# Altium project BLDCSuperBot.PrjPcb
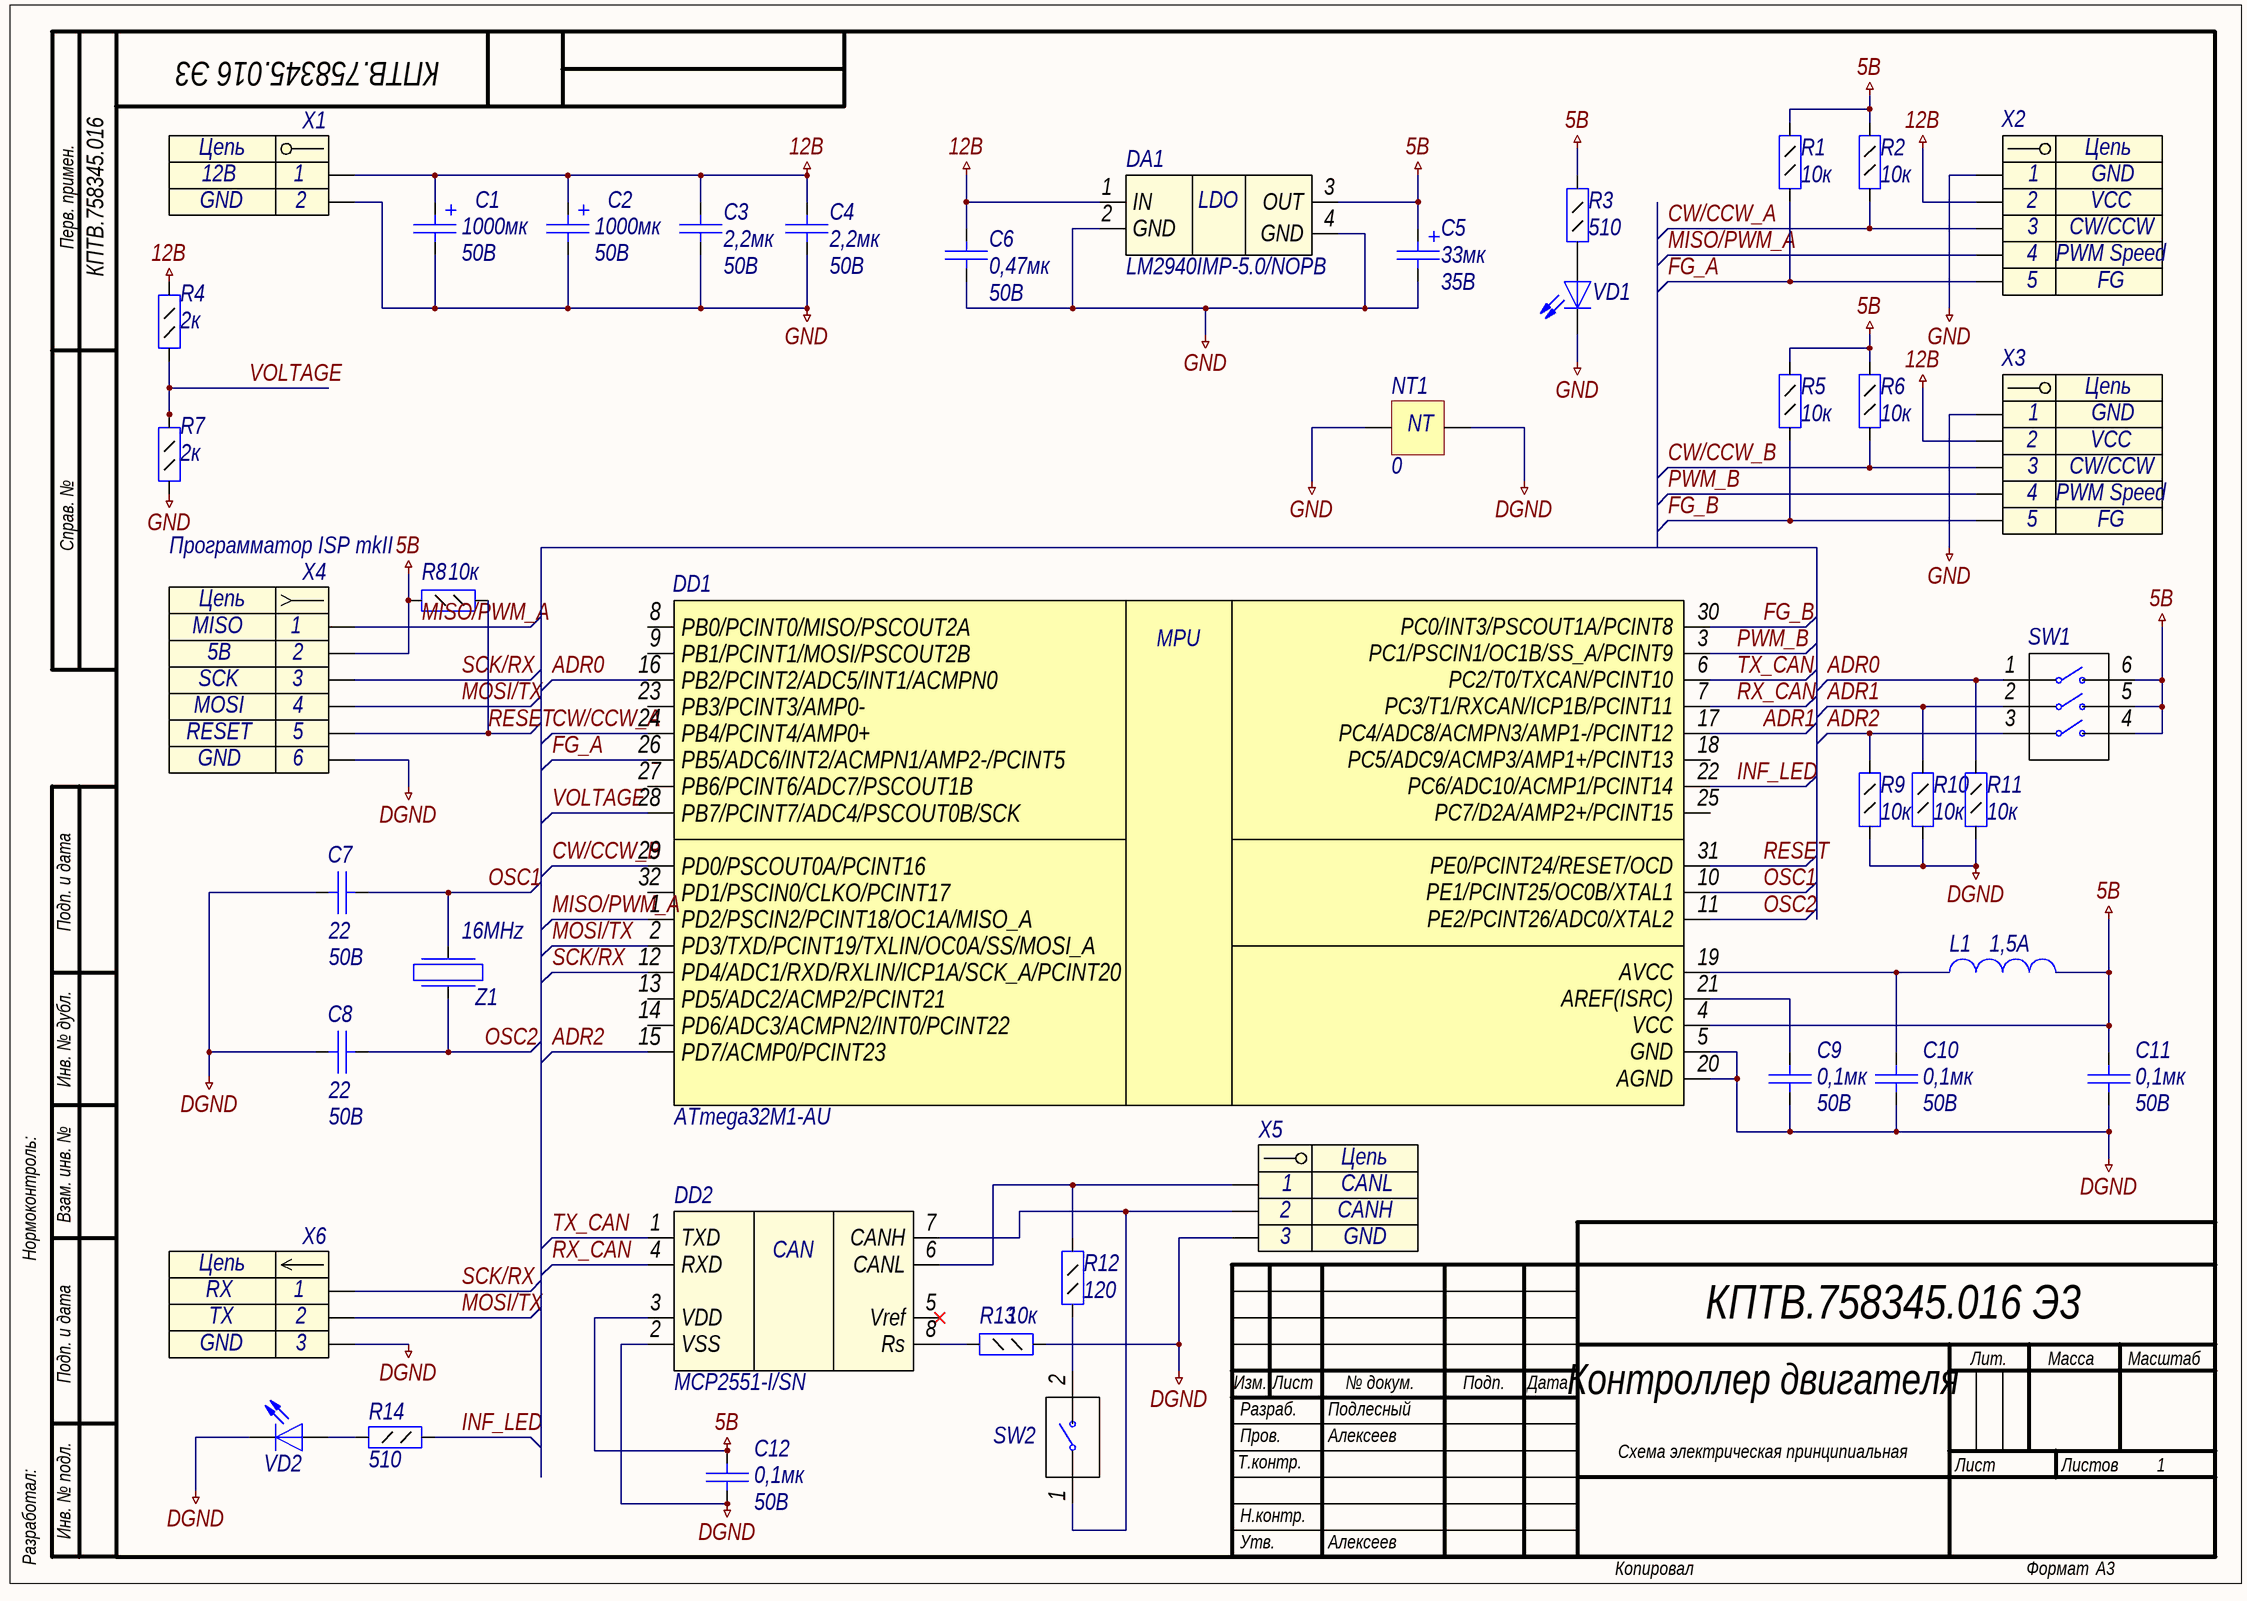
[diagram p0: BLDCSuperBot.schdoc]
1 sheet, 42 parts. Net scope: global (net labels, ports and power ports of the same name join across sheets).
Board file: BLDCSuperBot.PcbDoc

## Sheet BLDCSuperBot.schdoc: Контроллер двигателя
size 420 x 297 mm; ApprovedBy: Алексеев; CheckedBy: Алексеев; DrawnBy: Подлесный; DocumentNumber: КПТВ.758345.016 Э3; SheetTotal: 1; Title1str: (при необходимости вторая строка); DocumentType: Схема электрическая принципиальная; Format: A3; ImagePath: КПТВ.758345.016

### Parts
C1  value 1000мк  Voltage: 50В  [K50-35(13X25)_V]  (hidden comment: Capacitor_pol)
C2  value 1000мк  Voltage: 50В  [K50-35(13X25)_V]  (hidden comment: Capacitor_pol)
C3  value 2,2мк  Voltage: 50В  [C1206]  (hidden comment: Capacitor)
C4  value 2,2мк  Voltage: 50В  [C1206]  (hidden comment: Capacitor)
C5  value 33мк  Voltage: 35В  [TANTAL CASE D]  (hidden comment: Capacitor_pol)
C6  value 0,47мк  Voltage: 50B  [C0805]  (hidden comment: Capacitor)
C7  value 22  Voltage: 50В  [C0805]  (hidden comment: Capacitor)
C8  value 22  Voltage: 50В  [C0805]  (hidden comment: Capacitor)
C9  value 0,1мк  Voltage: 50В  [C0805]  (hidden comment: Capacitor)
C10  value 0,1мк  Voltage: 50В  [C0805]  (hidden comment: Capacitor)
C11  value 0,1мк  Voltage: 50В  [C0805]  (hidden comment: Capacitor)
C12  value 0,1мк  Voltage: 50В  [C0805]  (hidden comment: Capacitor)
DA1  Part Number: LM2940IMP-5.0/NOPB  [SOT-223]  (hidden comment: LM2940IMP)
DD1  ATmega32M1-AU  [TQFP-32]
DD2  MCP2551-I/SN  [SO8]
L1  Rated Current: 1,5A  [L0603]  (hidden comment: Inductor)
NT1  value 0  [Pofigistor0603]  (net tie, no BOM)
R1  value 10к  [R0805]  (hidden comment: Resistor_0,125Вт)
R2  value 10к  [R0805]  (hidden comment: Resistor_0,125Вт)
R3  value 510  [R0805]  (hidden comment: Resistor_0,125Вт)
R4  value 2к  [R0805]  (hidden comment: Resistor_0,125Вт)
R5  value 10к  [R0805]  (hidden comment: Resistor_0,125Вт)
R6  value 10к  [R0805]  (hidden comment: Resistor_0,125Вт)
R7  value 2к  [R0805]  (hidden comment: Resistor_0,125Вт)
R8  value 10к  [R0805]  (hidden comment: Resistor_0,125Вт)
R9  value 10к  [R0805]  (hidden comment: Resistor_0,125Вт)
R10  value 10к  [R0805]  (hidden comment: Resistor_0,125Вт)
R11  value 10к  [R0805]  (hidden comment: Resistor_0,125Вт)
R12  value 120  [R0805]  (hidden comment: Resistor_0,125Вт)
R13  value 10к  [R0805]  (hidden comment: Resistor_0,125Вт)
R14  value 510  [R0805]  (hidden comment: Resistor_0,125Вт)
SW1  (no value)  [DIP3]
SW2  DS1040-01  [DIP1]  (value not drawn)
VD1  LED  [L_0805]  (value not drawn)
VD2  LED  [L_0805]  (value not drawn)
X1  Header_2_trm  [TERMINAL-2WAY-5MM]  (value not drawn)
X2  Header_5_trm  [TERMINAL-5WAY-3.5MM_]  (value not drawn)
X3  Header_5_trm  [TERMINAL-5WAY-3.5MM]  (value not drawn)
X4  Программатор ISP mkII  [PLS2-6]
X5  Header_3_trm  [TERMINAL-3WAY-3.5MM]  (value not drawn)
X6  Header_3_plg  [PLS-3]  (value not drawn)
Z1  Frequence: 16MHz  [HC-49S]  (hidden comment: Crystal)

### Nets
5B: C5.1 C11.2 C12.2 DA1.3(OUT) DD1.4(VCC) DD2.3(VDD) L1.2 R1.1 R2.1 R3.2 R5.1 R6.1 R8.2 SW1.4 SW1.5 SW1.6 X4.2
12B: C1.1 C2.1 C3.2 C4.2 C6.2 DA1.1(IN) R4.2 X1.1 X2.2 X3.2
DGND: C7.2 C8.2 C9.1 C10.1 C11.1 C12.1 DD1.5(GND) DD1.20(AGND) DD2.2(VSS) NT1.2 R9.2 R10.2 R11.2 R13.1 VD2.1(K) X4.6 X5.3 X6.3
GND: C1.2 C2.2 C3.1 C4.1 C5.2 C6.1 DA1.2(GND) DA1.4(GND) NT1.1 R7.1 VD1.1(K) X1.2 X2.1 X3.1
ADR0: DD1.16(PB2/PCINT2/ADC5/INT1/ACMPN0) R11.1 SW1.1
ADR1: DD1.17(PC4/ADC8/ACMPN3/AMP1-/PCINT12) R10.1 SW1.2
ADR2: DD1.15(PD7/ACMP0/PCINT23) R9.1 SW1.3
CW/CCW_A: DD1.24(PB4/PCINT4/AMP0+) R2.2 X2.3
CW/CCW_B: DD1.29(PD0/PSCOUT0A/PCINT16) R6.2 X3.3
FG_A: DD1.26(PB5/ADC6/INT2/ACMPN1/AMP2-/PCINT5) R1.2 X2.5
FG_B: DD1.30(PC0/INT3/PSCOUT1A/PCINT8) R5.2 X3.5
INF_LED: DD1.22(PC6/ADC10/ACMP1/PCINT14) R14.1
MISO/PWM_A: DD1.1(PD2/PSCIN2/PCINT18/OC1A/MISO_A) X2.4 X4.1
MOSI/TX: DD1.2(PD3/TXD/PCINT19/TXLIN/OC0A/SS/MOSI_A) X4.4 X6.2
OSC1: C7.1 DD1.10(PE1/PCINT25/OC0B/XTAL1) Z1.2
OSC2: C8.1 DD1.11(PE2/PCINT26/ADC0/XTAL2) Z1.1
PWM_B: DD1.3(PC1/PSCIN1/OC1B/SS_A/PCINT9) X3.4
RESET: DD1.31(PE0/PCINT24/RESET/OCD) R8.1 X4.5
RX_CAN: DD1.7(PC3/T1/RXCAN/ICP1B/PCINT11) DD2.4(RXD)
SCK/RX: DD1.12(PD4/ADC1/RXD/RXLIN/ICP1A/SCK_A/PCINT20) X4.3 X6.1
TX_CAN: DD1.6(PC2/T0/TXCAN/PCINT10) DD2.1(TXD)
VOLTAGE: DD1.28(PB7/PCINT7/ADC4/PSCOUT0B/SCK) R4.1 R7.2
NetC9_2: C9.2 DD1.21(AREF(ISRC))
NetC10_2: C10.2 DD1.19(AVCC) L1.1
NetDD2_6: DD2.6(CANL) R12.2 X5.1
NetDD2_7: DD2.7(CANH) SW2.1 X5.2
NetDD2_8: DD2.8(Rs) R13.2
NetR3_1: R3.1 VD1.2(A)
NetR12_1: R12.1 SW2.2
NetR14_2: R14.2 VD2.2(A)

Not connected (* = marked no-connect by the designer): DD1 8(PB0/PCINT0/MISO/PSCOUT2A) 9(PB1/PCINT1/MOSI/PSCOUT2B) 13(PD5/ADC2/ACMP2/PCINT21) 14(PD6/ADC3/ACMPN2/INT0/PCINT22) 18(PC5/ADC9/ACMP3/AMP1+/PCINT13) 23(PB3/PCINT3/AMP0-) 25(PC7/D2A/AMP2+/PCINT15) 27(PB6/PCINT6/ADC7/PSCOUT1B) 32(PD1/PSCIN0/CLKO/PCINT17); DD2 5(Vref)*

### Notes on the sheet
- Перв. примен.
- Справ. №
- Подп. и дата
- Инв. № дубл.
- Нормоконтроль:
- Взам. инв. №
- Изм.
- Лист
- № докум.
- Подп.
- Дата
- Лит.
- Масса
- Масштаб
- Т.контр.
- Пров.
- Разраб.
- Листов
- Разработал:
- Инв. № подл.
- Н.контр.
- Утв.
- Копировал
- Формат
- (in symbol connect0) Цепь
- (in symbol connect21) Цепь
- (in symbol connect33) Цепь
- (in symbol connect35) Цепь
- (in symbol connect60) Цепь
- (in symbol connect61) Цепь
- (in symbol interf12) CAN
- (in symbol microcont12) MPU
- (in symbol pwr4) LDO
- (in symbol res1930) NT

### Library data of the parts
C1 C2 = cap262: Конденсатор полярный; Part Name: Electrolit; Manufacture: Jamicon; Part Number: TKR102M1HJ21; id: cap262; tga: 0,10%
C3 C4 = cap188: Конденсатор; Part Name: Capacitors; Part Number: GRM31CR71H225KA88**L; id: cap188; TKE: X7R
C5 = cap260: Конденсатор полярный; Part Name: Tantal; Manufacture: AVX; Part Number: TAJD336K035RNJ; id: cap260
C6 = cap148: Конденсатор; Part Name: Ceramic; Manufacture: Murata; Part Number: GRM219R71C474K; id: cap148; TKE: X7R
C7 C8 = cap222: Конденсатор; Part Name: Ceramic; Manufacture: Murata; Part Number: GRM21A5C2E220JW01D; id: cap222; TKE: X7R
C9-C12 = cap161: Конденсатор; Part Name: Capacitors; Part Number: GRM21BR71H104KA01L; id: cap161; TKE: X7R
DA1 = pwr4: Low-Dropout Regulator for 5-V to 3.3-V Conversion; Part Name: 1A Low Dropout Regulator; Manufacturer: Texas Instruments; id: pwr4; Input Voltage: 26B; Output Voltage: 5B; Dropout Voltage: 1V; Current: 1A; Type: Linear
DD1 = microcont12: Микроконтроллер 8-Бит, AVR, 16МГц, 32КБ Flash; Part Name: Microcontroller; Frequency: 16MHz; ADC: 11x10b; Interface: can, i2c, lin, spi, uart; Flash: 32kb; Pin in: 23; Power Supply: 2.7-5.5 V; id: microcont12; Part Number: ATmega32M1-AU
DD2 = interf12: High-Speed CAN Transceiver; Manufacture: Microchip; Mode of Work: half-duplex; Type Supply: Single Polar; Power Supply: 4.5-5.5V; id: interf12; Part Name: CAN Transceiver; Part Number: MCP2551-I/SN
L1 = ind0: EMI Suppression Filter; Part Name: EMI Suppression Filters; Part Number: BLM18PG181SN1D; id: ind0; Resistance: 0,09Ohm
NT1 = res1930: id: res1930; Part Name: Pofigistor
R1 R2 R5 R6 R8-R11 R13 = res97: Резистор; id: res97; Accuracy: 1%; Part Name: Resistor; Power: 0,125Вт
R3 R14 = res66: Резистор; Manufacture: Yageo; Part Number: RC0805FR-07510RL; id: res66; Accuracy: 0,01; Part Name: Resistor; Power: 0,125Вт
R4 R7 = res84: Резистор; Manufacture: Yageo; Part Number: RC0805FR-072KL; id: res84; Accuracy: 0,01; Part Name: Resistor; Power: 0,125Вт
R12 = res51: Резистор; Manufacture: Yageo; Part Number: RC0805FR-07120RL; id: res51; Accuracy: 0,01; Part Name: Resistor; Power: 0,125Вт
SW1 = btn6: DIP переключатель адреса; Part Name: Switch dip 3 pin; Part Number: DS1040-03RN; id: btn6; Etch: 2,54
SW2 = btn1: DIP переключатель; Part Name: Switch dip 1 pin; Part Number: DS1040-01RN; id: btn1; Etch: 2,54
VD1 VD2 = diode5: Светодиод; Part Number: KP-2012EC; id: diode5; Part Name: LED
X1 = connect21: Разъем - 2 конт. клеммник; Part Name: TERMINAL BLOCK 2 way; Contact_1: 12B; Contact_2: GND; Etch: 5mm; id: connect21
X2 = connect61: Разъем - 5 конт. клеммник; Part Name: TERMINAL BLOCK 5 way; Contact_1: GND; Contact_2: VCC; Contact_3: CW/CCW; Contact_4: PWM Speed; Contact_5: FG; Etch: 3.5mm; id: connect61
X3 = connect60: Разъем - 5 конт. клеммник; Part Name: TERMINAL BLOCK 5 way; Contact_1: GND; Contact_2: VCC; Contact_3: CW/CCW; Contact_4: PWM Speed; Contact_5: FG; Etch: 3.5mm; id: connect60
X4 = connect0: Разъем - 6 конт. розетка; Contact_1: MISO; Contact_2: 5B; Contact_3: SCK; Contact_4: MOSI; Contact_5: RESET; Contact_6: GND; Part Name: MKII; id: connect0
X5 = connect35: Разъем - 3 конт. клеммник; Part Name: TERMINAL BLOCK 3 way; Contact_1: CANL; Contact_2: CANH; Contact_3: GND; Etch: 3.5mm; id: connect35
X6 = connect33: Разъем - 3 конт. вилка; Part Number: DS1021-1*3SF112-B; Manufacture: Ningbo connfly electronic; Contact_1: RX; Contact_2: TX; Contact_3: GND; Etch: 2,54mm; Part Name: PLS-3; id: connect33
Z1 = crystal7: Кварцевый резонатор; Part Number: 16.000MHzHC-49US; id: crystal7